# EAGLE design MIDITheremin10-24 (EAGLE 7.7.0)
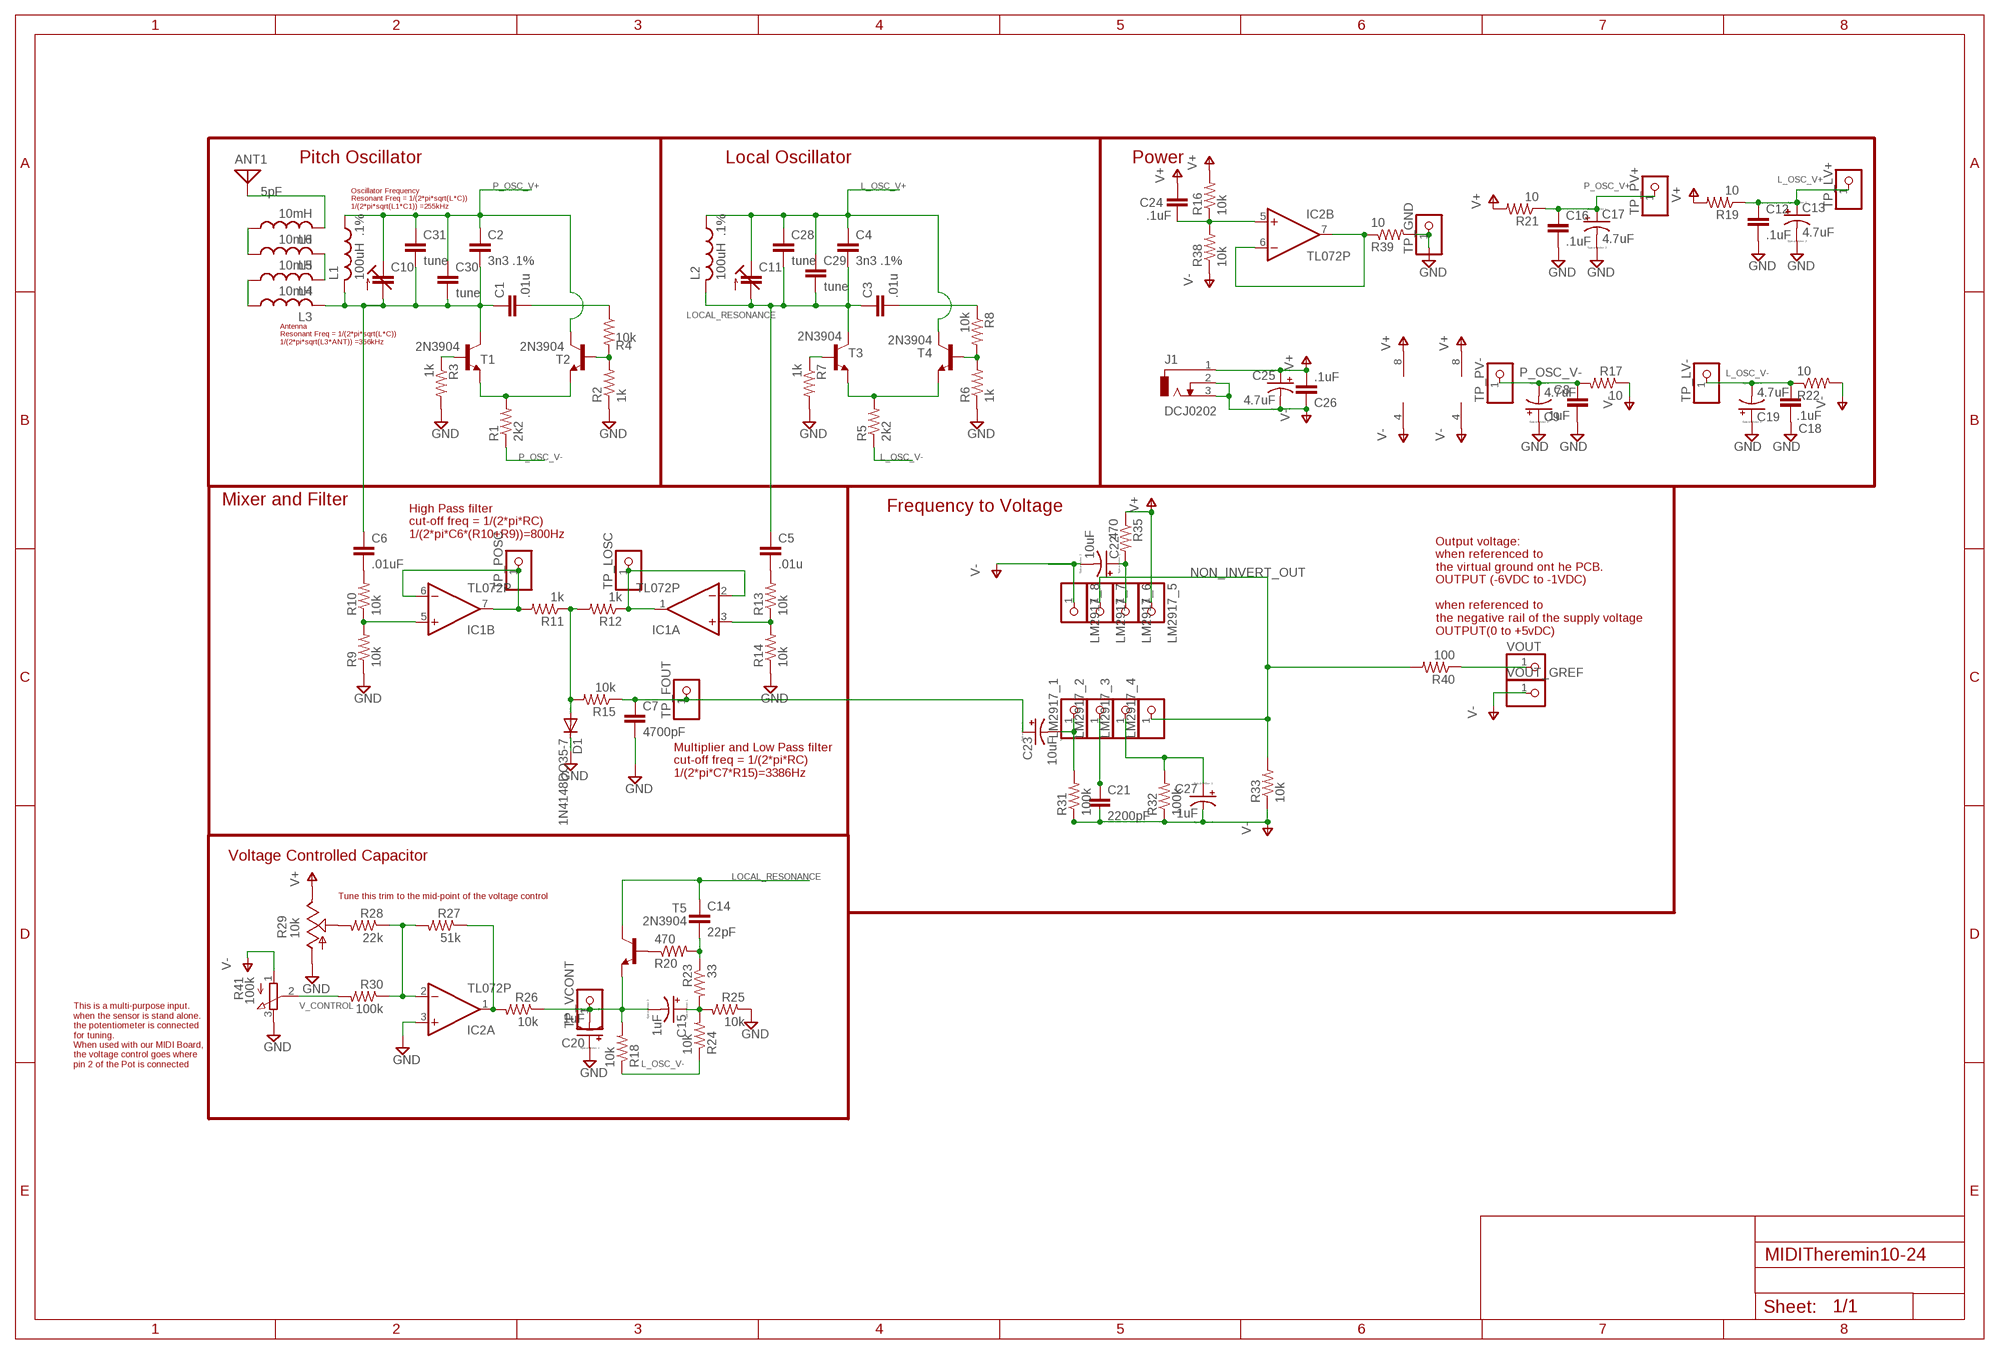
[diagram p0: schematic, sheet 1]

## Parts
ANT1  5pF  ANTENNA  [PAD-01]
C1  .01u  C-EU050-025X075  [C050-025X075]
C2  3n3 .1%  C-EU050-025X075  [C050-025X075]
C3  .01u  C-EU050-025X075  [C050-025X075]
C4  3n3 .1%  C-EU050-025X075  [C050-025X075]
C5  .01u  C-EU050-025X075  [C050-025X075]
C6  .01uF  C-EU050-025X075  [C050-025X075]
C7  4700pF  C-EU050-025X075  [C050-025X075]
C8  .1uF  C-EU050-025X075  [C050-025X075]
C9  4.7uF  CPOL-USE2.5-7  [E2,5-7]
C10  C-TRIMM3040.427  [CTRIM3040.427]
C11  C-TRIMM3040.427  [CTRIM3040.427]
C12  .1uF  C-EU050-025X075  [C050-025X075]
C13  4.7uF  CPOL-USE2.5-7  [E2,5-7]
C14  22pF  C-EU050-025X075  [C050-025X075]
C15  1uF  CPOL-USE2.5-7  [E2,5-7]
C16  .1uF  C-EU050-025X075  [C050-025X075]
C17  4.7uF  CPOL-USE2.5-7  [E2,5-7]
C18  .1uF  C-EU050-025X075  [C050-025X075]
C19  4.7uF  CPOL-USE2.5-7  [E2,5-7]
C20  1uF  CPOL-USE2.5-7  [E2,5-7]
C21  2200pF  C-EU050-025X075  [C050-025X075]
C22  10uF  CPOL-USE2.5-7  [E2,5-7]
C23  10uF  CPOL-USE2.5-7  [E2,5-7]
C24  .1uF  C-EU050-025X075  [C050-025X075]
C25  4.7uF  CPOL-USE2.5-7  [E2,5-7]
C26  .1uF  C-EU050-025X075  [C050-025X075]
C27  1uF  CPOL-USE2.5-7  [E2,5-7]
C28  tune  C-EU050-025X075  [C050-025X075]
C29  tune  C-EU050-025X075  [C050-025X075]
C30  tune  C-EU050-025X075  [C050-025X075]
C31  tune  C-EU050-025X075  [C050-025X075]
D1  1N4148DO35-7  [DO35-7]
IC1  TL072P  [DIL08]
IC2  TL072P  [DIL08]
J1  DCJ0202  [DCJ0202]
L1  100uH .1%  L-US6000-XXX-RC  [6000-XXXX-RC]
L2  100uH .1%  L-US6000-XXX-RC  [6000-XXXX-RC]
L3  10mH  L-US6000-XXX-RC  [6000-XXXX-RC]
L4  10mH  L-US6000-XXX-RC  [6000-XXXX-RC]
L5  10mH  L-US6000-XXX-RC  [6000-XXXX-RC]
L6  10mH  L-US6000-XXX-RC  [6000-XXXX-RC]
LM2917_1  PINHD-1X1  [1X01]
LM2917_2  PINHD-1X1  [1X01]
LM2917_3  PINHD-1X1  [1X01]
LM2917_4  PINHD-1X1  [1X01]
LM2917_5  PINHD-1X1  [1X01]
LM2917_6  PINHD-1X1  [1X01]
LM2917_7  PINHD-1X1  [1X01]
LM2917_8  PINHD-1X1  [1X01]
R1  2k2  R-US_0411/3V  [0411V]
R2  1k  R-US_0411/3V  [0411V]
R3  1k  R-US_0411/3V  [0411V]
R4  10k  R-US_0411/3V  [0411V]
R5  2k2  R-US_0411/3V  [0411V]
R6  1k  R-US_0411/3V  [0411V]
R7  1k  R-US_0411/3V  [0411V]
R8  10k  R-US_0411/3V  [0411V]
R9  10k  R-US_0411/3V  [0411V]
R10  10k  R-US_0411/3V  [0411V]
R11  1k  R-US_0411/3V  [0411V]
R12  1k  R-US_0411/3V  [0411V]
R13  10k  R-US_0411/3V  [0411V]
R14  10k  R-US_0411/3V  [0411V]
R15  10k  R-US_0411/3V  [0411V]
R16  10k  R-US_0411/3V  [0411V]
R17  10  R-US_0411/3V  [0411V]
R18  10k  R-US_0411/3V  [0411V]
R19  10  R-US_0411/3V  [0411V]
R20  470  R-US_0411/3V  [0411V]
R21  10  R-US_0411/3V  [0411V]
R22  10  R-US_0411/3V  [0411V]
R23  33  R-US_0411/3V  [0411V]
R24  10k  R-US_0411/3V  [0411V]
R25  10k  R-US_0411/3V  [0411V]
R26  10k  R-US_0411/3V  [0411V]
R27  51k  R-US_0411/3V  [0411V]
R28  22k  R-US_0411/3V  [0411V]
R29  10k  TRIM_US-B64Y  [B64Y]
R30  100k  R-US_0411/3V  [0411V]
R31  100k  R-US_0411/3V  [0411V]
R32  100k  R-US_0411/3V  [0411V]
R33  10k  R-US_0411/3V  [0411V]
R35  470  R-US_0411/3V  [0411V]
R38  10k  R-US_0411/3V  [0411V]
R39  10  R-US_0411/3V  [0411V]
R40  100  R-US_0411/3V  [0411V]
R41  100k  3RP/1610N  [3RP/1610N]
T1  2N3904  [TO92]
T2  2N3904  [TO92]
T3  2N3904  [TO92]
T4  2N3904  [TO92]
T5  2N3904  [TO92]
TP_FOUT  PINHD-1X1  [1X01]
TP_GND  PINHD-1X1  [1X01]
TP_LOSC  PINHD-1X1  [1X01]
TP_LV+  PINHD-1X1  [1X01]
TP_LV-  PINHD-1X1  [1X01]
TP_POSC  PINHD-1X1  [1X01]
TP_PV+  PINHD-1X1  [1X01]
TP_PV-  PINHD-1X1  [1X01]
TP_VCONT  PINHD-1X1  [1X01]
VOUT  PINHD-1X1  [1X01]
VOUT_GREF  PINHD-1X1  [1X01]

## Nets
ANT: ANT1.1 L6.2
GND: C7.2 C8.2 C9.+ C12.2 C13.- C16.2 C17.- C18.2 C19.+ C20.+ D1.C IC2.3(A:+IN) R2.1 R3.2 R6.1 R7.2 R9.1 R14.1 R25.1 R29.A R39.2 R41.3(E) TP_GND.1
L_OSC_V+: C4.1 C11.1A(E) C12.1 C13.+ C28.1 C29.1 L2.1 R19.1 T4.1(C) TP_LV+.1
L_OSC_V-: C18.1 C19.- R5.1 R18.1 R22.1 R24.1 TP_LV-.1
LOCAL_RESONANCE: C3.1 C4.2 C5.1 C11.2(A) C14.1 C28.2 C29.2 L2.2 T3.1(C) T5.1(C)
N$1: R1.2 T1.3(E) T2.3(E)
N$2: R2.2 R4.2 T2.2(B)
N$3: R3.1 T1.2(B)
N$4: C1.1 C2.2 C6.1 C10.2(A) C30.2 C31.2 L1.2 L3.2 T1.1(C)
N$5: C1.2 R4.1
N$6: R5.2 T3.3(E) T4.3(E)
N$7: R6.2 R8.2 T4.2(B)
N$8: R7.1 T3.2(B)
N$9: C15.- C20.- R18.2 R26.1 T5.3(E) TP_VCONT.1
N$10: C5.2 R13.2
N$11: IC1.6(B:-IN) IC1.7(B:OUT) R11.2 TP_POSC.1
N$12: IC1.1(A:OUT) IC1.2(A:-IN) R12.1 TP_LOSC.1
N$13: IC1.5(B:+IN) R9.2 R10.1
N$14: D1.A R11.1 R12.2 R15.2
N$15: IC1.3(A:+IN) R13.1 R14.2
N$16: C3.2 R8.1
N$17: C6.2 R10.2
N$18: C7.1 C23.+ R15.1 TP_FOUT.1
N$19: L5.1 L6.1
N$20: C21.1 LM2917_2.1
N$21: R20.1 T5.2(B)
N$22: C14.2 R20.2 R23.1
N$23: C15.+ R23.2 R24.2 R25.2
N$24: IC2.1(A:OUT) R26.2 R27.1
N$25: IC2.2(A:-IN) R27.2 R28.1 R30.1
N$26: R28.2 R29.S
N$27: IC2.6(B:-IN) IC2.7(B:OUT) R39.1
N$28: L3.1 L4.1
N$31: C22.+ LM2917_6.1 R35.2
N$33: C27.+ LM2917_3.1 R32.2
N$34: C23.- LM2917_1.1 R31.2
N$35: L4.2 L5.2
N$36: C24.2 IC2.5(B:+IN) R16.1 R38.2
N$38: R40.1 VOUT.1
NON_INVERT_OUT: LM2917_4.1 LM2917_7.1 R33.2 R40.2
P_OSC_V+: C2.1 C10.1A(E) C16.1 C17.+ C30.1 C31.1 L1.1 R21.1 T2.1(C) TP_PV+.1
P_OSC_V-: C8.1 C9.- R1.1 R17.2 TP_PV-.1
V+: C24.1 C25.+ C26.2 IC1.8(P:V+) IC2.8(P:V+) J1.1 LM2917_5.1 R16.2 R19.2 R21.2 R29.E R35.1
V-: C21.2 C22.- C25.- C26.1 C27.- IC1.4(P:V-) IC2.4(P:V-) J1.2 J1.3 LM2917_8.1 R17.1 R22.2 R31.1 R32.1 R33.1 R38.1 R41.1(A) VOUT_GREF.1
V_CONTROL: R30.2 R41.2(S)

## Notes on the sheet
- Pitch Oscillator | Local Oscillator | Power
- Oscillator Frequency
  Resonant Freq = 1/(2*pi*sqrt(L*C)) 
  1/(2*pi*sqrt(L1*C1)) =255kHz
- Antenna
  Resonant Freq = 1/(2*pi*sqrt(L*C)) 
  1/(2*pi*sqrt(L3*ANT)) =356kHz
- Mixer and Filter
- Frequency to Voltage
- High Pass filter
  cut-off freq = 1/(2*pi*RC) 
  1/(2*pi*C6*(R10+R9))=800Hz
- Output voltage: 
  when referenced to 
  the virtual ground ont he PCB.
  OUTPUT (-6VDC to -1VDC)
  
  when referenced to 
  the negative rail of the supply voltage
  OUTPUT(0 to +5vDC)
- Multiplier and Low Pass filter
  cut-off freq = 1/(2*pi*RC) 
  1/(2*pi*C7*R15)=3386Hz
- Voltage Controlled Capacitor
- Tune this trim to the mid-point of the voltage control
- This is a multi-purpose input.
  when the sensor is stand alone.
  the potentiometer is connected 
  for tuning. 
  When used with our MIDI Board, 
  the voltage control goes where
  pin 2 of the Pot is connected

## Library data of the parts
ANT1 = discrete:ANTENNA: Antenna
C1-C8 C12 C14 C16 C18 C21 C24 C26 C28-C31 = resistor:C-EU: CAPACITOR, European symbol
C9 C13 C15 C17 C19 C20 C22 C23 C25 C27 = resistor:CPOL-US: POLARIZED CAPACITOR, American symbol
C10 C11 = rcl:C-TRIMM: Trimm capacitor
D1 = diode:1N4148: DIODE high speed (Philips)
IC1 IC2 = linear:TL072: OP AMP
J1 = con-jack:DCJ0202: DC POWER JACK Source: DCJ0202.pdf; OC_FARNELL: unknown; OC_NEWARK: unknown
L1-L6 = rcl:L-US: INDUCTOR, American symbol
LM2917_1-LM2917_8 TP_FOUT TP_GND TP_LOSC TP_LV+ TP_LV- TP_POSC TP_PV+ TP_PV- TP_VCONT VOUT VOUT_GREF = pinhead:PINHD-1X1: PIN HEADER
R1-R28 R30 R38 R39 = resistor:R-US_: RESISTOR, American symbol
R29 = pot:TRIM_US-: POTENTIOMETER
R31-R33 R35 R40 = rcl:R-US_: RESISTOR, American symbol
R41 = pot:3RP/1610N: 16mm Potentiometer one level Source: http://www.alphapotentiometers.net/html/16mm_pot_2.html
T1-T5 = transistor-neu-to92:2N3904: NPN TRANSISTOR

## Board
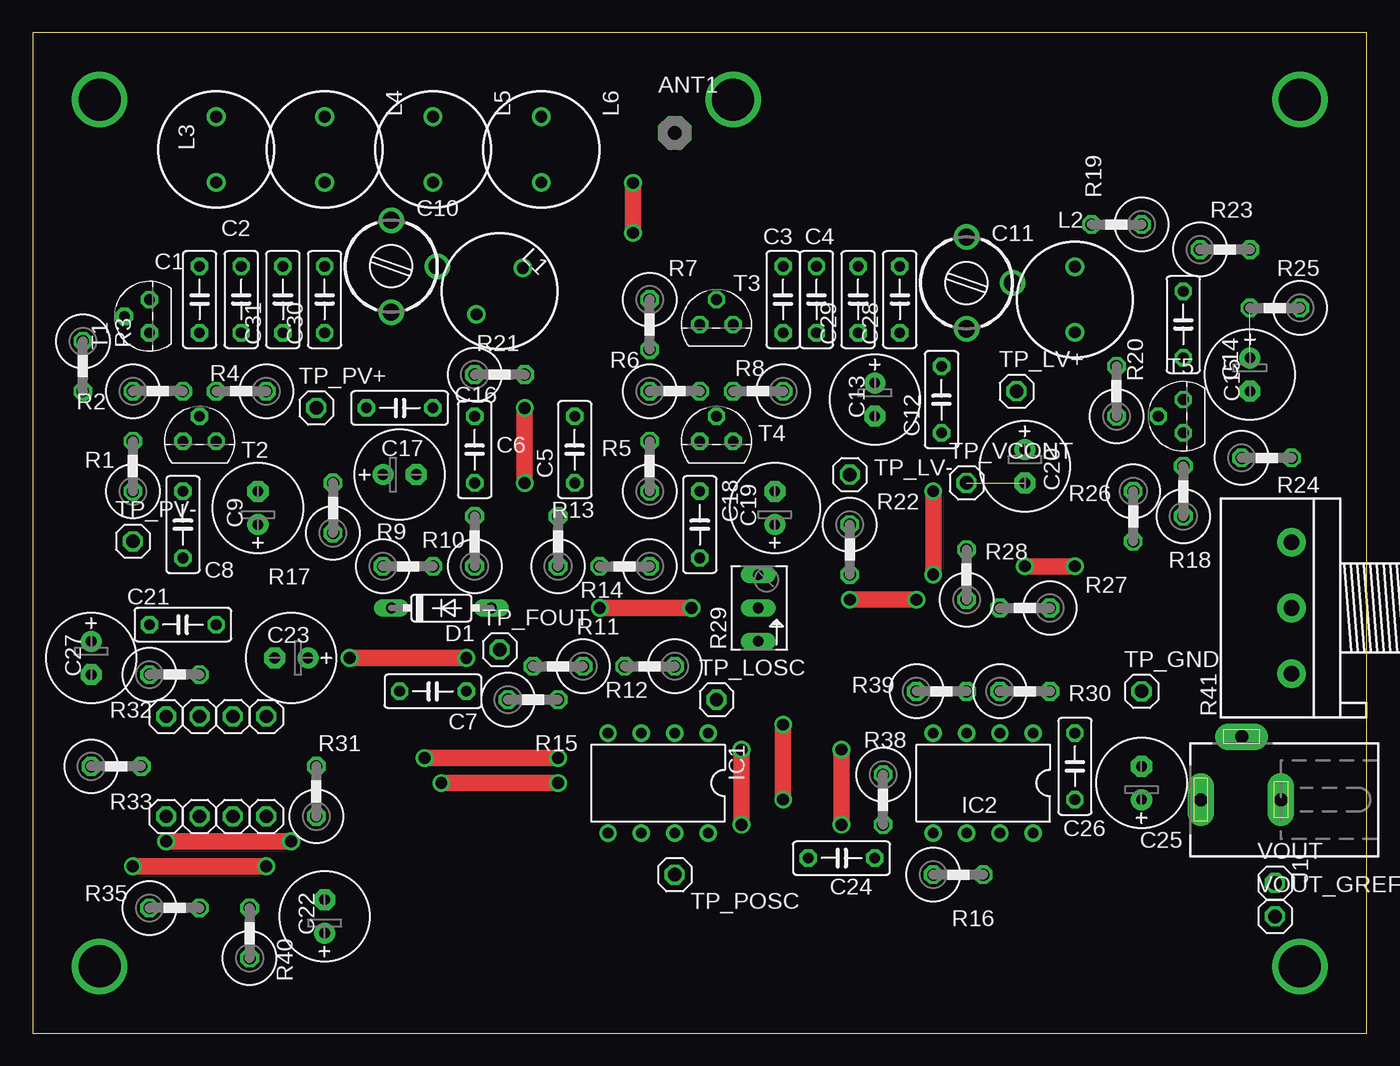
[diagram p1: board, top side]
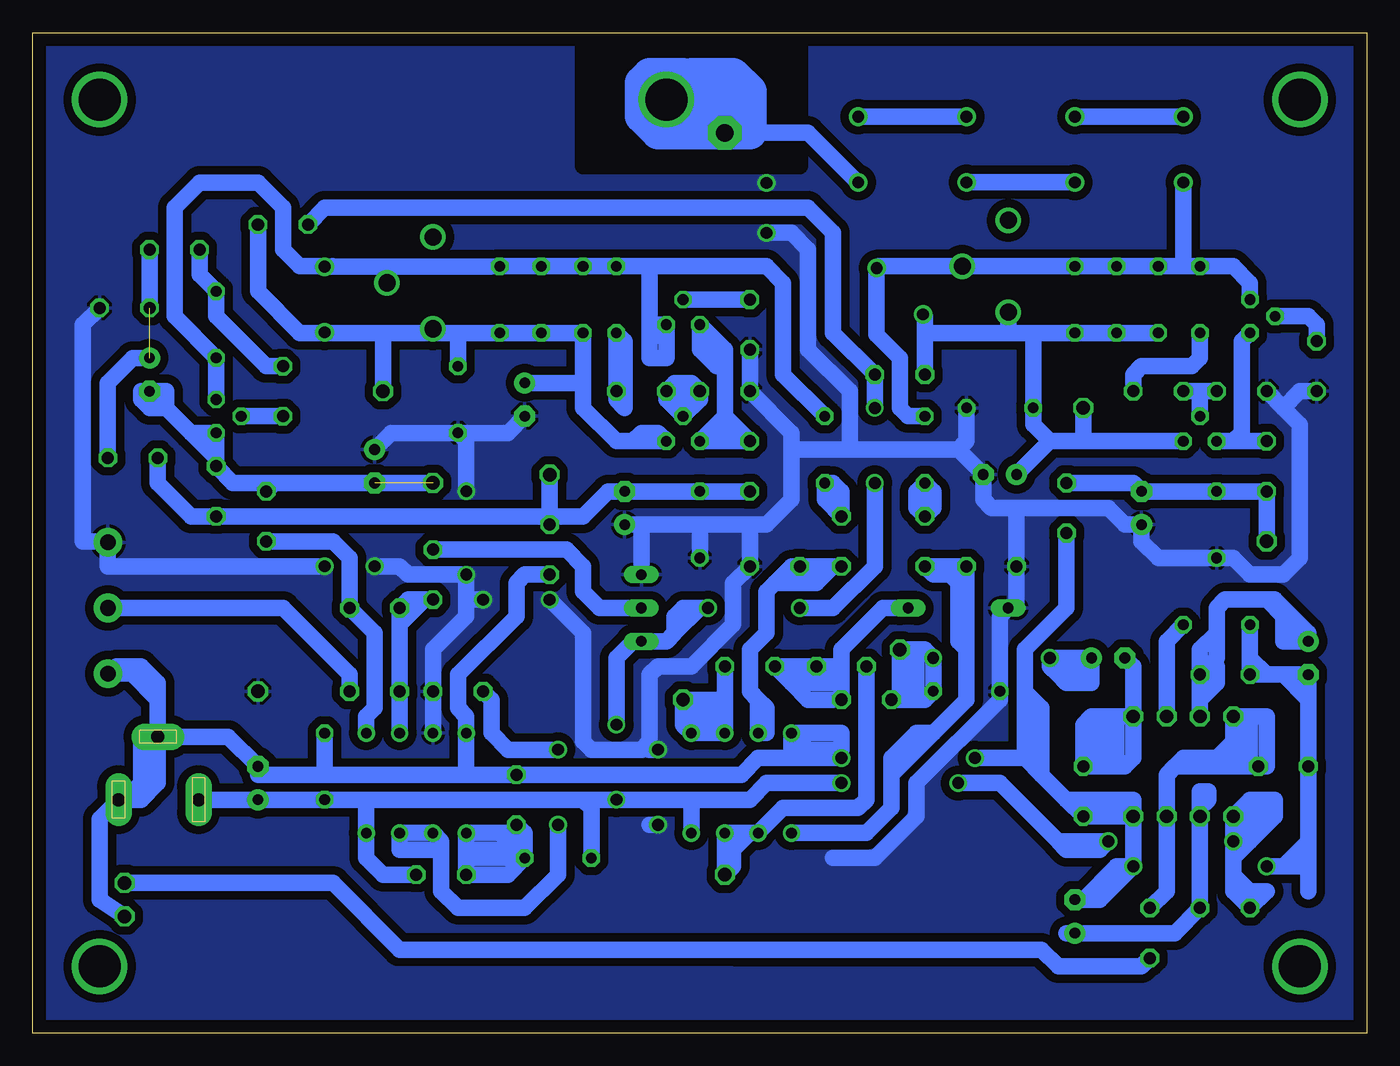
[diagram p2: board, bottom side, seen from below]

Size 101.6 x 76.2 mm. Coordinates in mm from the lower left corner, seen from the top.
Outline: 0,0 101.6,0 101.6,76.2 0,76.2 0,0
Copper layers (1*16): Top 0.035mm / dielectric 1.5mm / Bottom 0.035mm
Design rules "default": minimum track width 10mil, minimum drill 24mil, track to track 8mil, track to pad 8mil, pad to pad 8mil, via to via 8mil, smd to smd 8mil, copper to edge 40mil, drill to drill 8mil, minimum pad ring 10mil, minimum via ring 8mil, stop-mask expansion 4mil, vias tented up to drill 0mil, thermal gap 10mil
tRestrict: area 12.7,60.3 to 28.6,68.6
bRestrict: area 43.2,66 to 59.7,76.2

### Footprints (pad centres in the part's own frame; a part is rotated, then mirrored left to right if it is on the bottom)
PAD-01 = drill 1.321 pad 2.54 octagon: 1 0,0
C050-025X075 = drill 0.813 octagon: 1 -2.54,0; 2 2.54,0
E2,5-7 = drill 0.813 pad 1.6: + -1.27,0 | drill 0.813 pad 1.6 octagon: - 1.27,0
CTRIM3040.427 = drill 1.3: 1A -3.5,0; 1B 3.5,0; 2 0,-3.5
DO35-7 = drill 0.813 long: A 3.81,0; C -3.81,0
DIL08 = drill 0.813 pad 1.27: 1 -3.81,-3.81; 2 -1.27,-3.81; 3 1.27,-3.81; 4 3.81,-3.81; 5 3.81,3.81; 6 1.27,3.81; 7 -1.27,3.81; 8 -3.81,3.81
DCJ0202 = drill 1 pad 2 long: 1 0,3.1; 2 4.8,0; 3 0,-3
6000-XXXX-RC = drill 0.9 pad 1.422: 1 -2.5,0; 2 2.5,0
1X01 = drill 1.016 octagon: 1 0,0
0411V = drill 0.914 octagon: 1 -2.54,0; 2 1.27,0
B64Y = drill 0.813 long: A 2.54,0; E -2.54,0; S 0,0
3RP/1610N = drill 1.2 pad 2.184: 1 -5,0; 2 0,0; 3 5,0
TO92 = drill 0.813 octagon: 1 1.27,0; 2 0,1.905; 3 -1.27,0

### Placement (x,y rotation side)
ANT1  48.9,68.58 0 top
C1  12.7,55.88 270 top
C2  15.88,55.88 90 top
C3  57.15,55.88 270 top
C4  59.69,55.88 90 top
C5  41.27,44.45 270 top
C6  33.66,44.45 270 top
C7  30.48,26.04 180 top
C8  11.43,38.73 270 top
C9  17.14,40.01 90 top
C10  27.3,58.42 90 top
C11  71.12,57.15 90 top
C12  69.22,48.26 270 top
C13  64.14,48.26 270 top
C14  87.63,53.98 90 top
C15  92.71,50.16 270 top
C16  27.94,47.62 0 top
C17  27.94,42.55 0 top
C18  50.8,38.73 270 top
C19  56.52,40.01 90 top
C20  75.56,43.18 270 top
C21  11.43,31.11 180 top
C22  22.23,8.89 90 top
C23  19.68,28.57 180 top
C24  61.59,13.34 0 top
C25  84.45,19.05 90 top
C26  79.38,20.32 270 top
C27  4.45,28.57 270 top
C28  66.04,55.88 90 top
C29  62.87,55.88 90 top
C30  22.23,55.88 90 top
C31  19.05,55.88 90 top
D1  31.11,32.38 0 top
IC1  47.62,19.05 180 top
IC2  72.39,19.05 180 top
J1  92.08,17.78 90 top
L1  35.56,56.52 45 top
L2  79.38,55.88 90 top
L3  13.97,67.31 270 top
L4  22.23,67.31 270 top
L5  30.48,67.31 270 top
L6  38.73,67.31 270 top
LM2917_1  17.78,24.13 90 top
LM2917_2  15.24,24.13 90 top
LM2917_3  12.7,24.13 90 top
LM2917_4  10.16,24.13 90 top
LM2917_5  10.16,16.51 90 top
LM2917_6  12.7,16.51 90 top
LM2917_7  15.24,16.51 90 top
LM2917_8  17.78,16.51 90 top
R1  7.62,43.81 90 top
R2  10.16,48.9 0 top
R3  3.81,50.16 270 top
R4  15.24,48.9 180 top
R5  46.99,43.81 90 top
R6  49.53,48.9 0 top
R7  46.99,53.34 270 top
R8  54.61,48.9 180 top
R9  29.21,35.56 0 top
R10  33.66,38.1 90 top
R11  39.37,27.94 180 top
R12  46.35,27.94 180 top
R13  40.01,38.1 90 top
R14  44.45,35.56 180 top
R15  38.73,25.4 0 top
R16  71.12,12.06 0 top
R17  22.86,40.64 90 top
R18  87.63,41.91 90 top
R19  81.92,61.59 180 top
R20  82.55,49.53 90 top
R21  36.2,50.16 0 top
R22  62.23,36.2 270 top
R23  91.44,59.69 0 top
R24  94.61,43.81 0 top
R25  93.98,55.24 180 top
R26  83.82,38.73 270 top
R27  74.93,32.38 180 top
R28  71.12,35.56 90 top
R29  55.24,32.38 90 top
R30  76.2,26.04 0 top
R31  21.59,19.05 90 top
R32  11.43,27.3 0 top
R33  6.99,20.32 0 top
R35  11.43,9.53 0 top
R38  64.77,17.14 270 top
R39  69.85,26.04 0 top
R40  16.51,8.26 90 top
R41  95.89,32.38 90 top
T1  8.89,54.61 90 top
T2  12.7,45.09 0 top
T3  52.07,53.98 0 top
T4  52.07,45.09 0 top
T5  87.63,46.99 90 top
TP_FOUT  35.56,29.21 0 top
TP_GND  84.45,26.04 0 top
TP_LOSC  52.07,25.4 0 top
TP_LV+  74.93,48.9 0 top
TP_LV-  62.23,42.55 0 top
TP_POSC  48.9,12.06 0 top
TP_PV+  21.59,47.62 0 top
TP_PV-  7.62,37.47 0 top
TP_VCONT  71.12,41.91 0 top
VOUT  94.61,11.43 0 top
VOUT_GREF  94.61,8.89 0 top

### Tracks (layer width: path | path; a pad name or v marks a point on that pad's centre or on a via)
ANT  (via drill 3.2)
  Bottom 1.27: L6.2 38.77,64.81 42.55,68.58 46.99,68.58
  Bottom 2.54: ANT1.1 53.98,68.58 55.24,69.85 55.24,72.39 54.61,73.03 52.07,73.03 51.44,72.39 | 51.44,72.39 51.44,71.12 | ANT1.1 50.8,68.58 v53.34,71.12 | ANT1.1 46.99,68.58 46.99,71.75 48.26,73.03 51.44,73.03 51.44,72.39 | 51.44,71.12 51.44,70.48 50.8,70.48 | 47.62,70.48 50.8,70.48 | 50.8,70.48 51.44,71.12
GND  (via drill 0.9)
  Top 1.27: v68.58,41.27 v68.58,34.92 | v79.38,35.56 v75.56,35.56 | v45.72,60.96 v45.72,64.77 | v62.23,33.02 v67.31,33.02 | v53.98,21.59 v53.98,15.88
  Bottom 1.27: R7.2 R6.1 43.81,45.72 43.81,44.45 | 6.35,47.62 5.08,46.35 5.08,36.2 6.35,34.92 8.89,34.92 10.16,36.2 C8.2 15.88,36.2 17.14,37.47 C9.+ 18.41,38.73 19.68,40.01 26.67,40.01 | 6.35,47.62 R2.1 | C19.+ 55.24,38.73 | 55.24,38.73 50.8,38.73 | 50.8,38.73 46.99,38.73 | 46.99,38.73 45.72,38.73 43.81,40.64 43.81,44.45 | C18.2 50.8,38.73 | 46.99,38.73 R14.1 48.26,34.29 48.26,31.11 51.44,27.94 53.98,27.94 54.61,27.3 54.61,22.23 55.24,21.59 59.05,21.59 59.69,22.23 59.69,30.48 v62.23,33.02 | 26.67,40.01 R9.1 26.67,32.38 D1.C 27.94,31.75 C7.2 27.94,25.4 34.29,19.05 34.29,16.51 37.47,13.34 40.64,13.34 | 43.81,44.45 39.37,44.45 | IC2.3 R39.2 71.12,29.21 68.58,31.75 68.58,33.02 | v75.56,35.56 73.66,35.56 73.03,34.92 v68.58,34.92 68.58,33.02 | v79.38,35.56 95.89,35.56 95.89,37.47 97.79,37.47 97.79,53.98 R25.1 | R29.A 55.24,38.73 | v68.58,41.27 68.58,45.09 C12.2 | v67.31,33.02 68.58,33.02 | v45.72,60.96 43.81,60.96 42.55,59.69 42.55,52.07 39.37,48.9 39.37,44.45 | 54.61,21.59 v53.98,21.59 | v53.98,15.88 54.61,15.88 | C20.+ 74.3,45.72 C12.2 | C12.2 65.41,45.72 C13.- | R3.2 5.08,48.9 6.35,47.62 | 26.67,40.01 28.57,40.01 29.21,40.64 C17.- 31.11,44.45 | 39.37,44.45 31.11,44.45 | C16.2 30.48,45.09 31.11,44.45
  pour Bottom (isolate 0.635): 0,0 101.6,0 101.6,76.2 0,76.2
  pour Bottom: 48.26,5.08 48.26,0 89.53,0 89.53,5.08
L_OSC_V+
  Bottom 1.27: 55.88,45.09 T4.1 53.98,45.72 55.24,45.72 55.88,45.09 | 55.88,45.09 57.15,45.09 59.69,47.62 59.69,49.53 | 59.69,49.53 C4.1 C29.1 C28.1 69.22,53.34 | 69.22,53.34 71.12,53.34 | 71.12,53.34 74.93,53.34 | 74.93,53.34 79.33,53.34 L2.1 79.42,53.34 81.28,53.34 84.45,56.52 R19.1 | C13.+ 59.69,49.53 | C12.1 69.22,53.34 | C11.1A 71.12,53.34 | TP_LV+.1 74.93,53.34
L_OSC_V-
  Bottom 1.27: R5.1 C18.1 C19.- 57.78,41.27 59.69,39.37 62.23,39.37 | 62.23,39.37 R18.1 89.53,39.37 92.08,41.91 R24.1 | TP_LV-.1 62.23,39.37 | 62.23,39.37 R22.1
LOCAL_RESONANCE
  Bottom 1.27: 54.61,58.42 45.72,58.42 44.45,57.15 44.45,50.16 C5.1 | 54.61,58.42 C3.1 C4.2 C29.2 C28.2 66.72,58.38 74.93,58.38 | 54.61,53.98 T3.1 53.34,52.7 | 53.34,52.7 54.61,53.98 | 53.34,52.7 53.34,51.44 54.61,51.44 54.61,53.98 | 54.61,53.98 54.61,58.42 | T5.1 C14.1 90.81,54.61 90.81,62.87 88.9,64.77 84.45,64.77 82.55,62.87 82.55,59.69 81.28,58.42 79.42,58.42 L2.2 | L2.2 74.93,58.38 | 78.78,58.42 L2.2 | C11.2 74.62,58.07 74.93,58.38
N$1
  Bottom 1.27: R1.2 T2.3 10.16,45.09 9.53,45.72 9.53,52.7 T1.3
N$2
  Bottom 1.27: R4.2 12.7,48.9 | 12.7,48.9 R2.2 | T2.2 12.7,48.9
N$3
  Bottom 1.27: R3.1 3.81,53.98 4.45,54.61 T1.2
N$4
  Bottom 1.27: 30.84,58.38 C10.2 | C10.2 C30.2 C31.2 C2.2 13.97,58.42 | 13.97,58.42 C1.1 10.16,58.42 8.89,57.15 T1.1 | C6.1 34.92,46.99 35.56,47.62 35.56,51.44 37.33,53.2 L1.2 37.19,58.42 C10.2 | L3.2 13.97,58.42
N$5
  Bottom 1.27: R4.1 17.78,50.16 17.14,50.8 13.34,50.8 12.7,51.44 C1.2
N$6
  Bottom 1.27: 48.9,46.99 T4.3 R5.2 | 48.9,46.99 48.9,52.07 T3.3 50.8,52.07 49.53,50.8 49.53,51.44 50.16,52.07 | R5.2 48.9,46.99 | R5.2 48.26,45.09 48.9,45.72
N$7
  Bottom 1.27: R8.2 52.07,48.9 | 52.07,48.9 R6.2 | T4.2 52.07,48.9 | R6.2 51.44,49.53 52.7,49.53 R8.2 | R8.2 53.34,48.26 T4.2 | T4.2 50.8,48.26 R6.2
N$8
  Bottom 1.27: T3.2 R7.1
N$9  (1 unrouted)
  Bottom 1.27: 87.63,43.81 T5.3 89.53,45.72 | 87.63,43.81 R18.2 86.36,41.91 83.19,41.91 | C15.- 91.44,47.62 | 91.44,47.62 89.53,45.72 | C15.- 91.44,48.9 91.44,47.62 | C15.- 93.34,48.9 93.34,48.26 92.71,47.62 91.44,47.62 | 87.63,43.81 89.53,45.72 | TP_VCONT.1 83.19,41.91 | 83.19,41.91 R26.1
N$10
  Bottom 1.27: R13.2 41.27,40.64 C5.2 40.64,41.91 40.01,41.27 R13.2
N$11
  Bottom 1.27: IC1.6 IC1.7 TP_POSC.1 48.26,12.7 48.26,13.97 46.99,15.24 IC1.6 | IC1.6 44.45,17.14 38.73,17.14 38.1,17.78 R11.2
N$12
  Bottom 1.27: 48.9,24.13 IC1.2 IC1.1 52.07,23.5 52.07,24.13 | 48.9,25.4 R12.1 | 52.07,24.13 TP_LOSC.1 48.9,25.4 | 48.9,25.4 48.9,24.13 | 48.9,24.13 52.07,24.13
N$13
  Bottom 1.27: IC1.5 38.1,15.24 36.2,17.14 36.2,19.68 | 30.48,29.21 30.48,25.4 33.02,22.86 | 30.48,29.21 R9.2 R10.1 33.02,34.92 31.75,34.92 31.11,34.29 31.11,29.84 30.48,29.21 | 33.02,22.86 36.2,19.68 | 36.2,19.68 36.2,20.95 34.29,22.86 33.02,22.86
N$14
  Bottom 1.27: 40.01,27.94 40.01,29.21 36.83,32.38 D1.A | 40.01,27.94 40.01,26.67 | 40.01,26.67 R15.2 | 40.01,27.94 R11.1 R12.2 43.81,26.67 | 40.64,25.4 42.55,25.4 43.81,26.67 | 43.81,26.67 40.01,26.67
N$15
  Bottom 1.27: 40.64,35.56 R14.2 43.81,35.56 45.09,34.29 | 40.64,35.56 R13.1 | 46.35,25.4 IC1.3 45.72,22.86 45.72,24.77 46.35,25.4 | 46.35,25.4 46.99,26.04 46.99,29.21 45.72,30.48 45.72,33.66 45.09,34.29 | 40.64,35.56 41.91,34.29 45.09,34.29
N$16
  Bottom 1.27: C3.2 R8.1 57.15,48.26 56.52,47.62 56.52,52.7 C3.2
N$17
  Bottom 1.27: C6.2 R10.2 | R10.2 33.02,40.01 33.02,41.27 C6.2 | C6.2 34.29,41.27 34.29,40.01 R10.2
N$18  (via drill 0.9)
  Top 1.27: v24.13,28.57 v33.02,28.57
  Bottom 1.27: R15.1 35.56,25.4 | 34.29,25.4 33.66,25.4 C7.1 v33.02,28.57 33.66,29.21 34.29,29.21 | 22.86,28.57 v24.13,28.57 | v24.13,28.57 C23.+ 20.95,27.3 | 34.29,29.21 TP_FOUT.1 35.56,25.4 | 35.56,25.4 34.29,25.4 | 34.29,25.4 34.29,29.21 | 20.95,27.3 20.95,26.67 22.86,26.67 23.5,27.3 | 23.5,27.3 24.13,27.94 v24.13,28.57 | 20.95,27.3 23.5,27.3
N$19
  Bottom 1.27: L5.1 L6.1
N$20
  Bottom 1.27: LM2917_2.1 15.24,29.84 C21.1
N$21
  Bottom 1.27: T5.2 R20.1
N$22
  Bottom 1.27: R23.1 88.9,57.78 C14.2 87.63,54.61 83.82,50.8 R20.2
N$23  (1 unrouted)
  Bottom 1.27: R24.2 95.89,49.53 93.98,51.44 C15.+ | R23.2 R25.2
N$24
  Bottom 1.27: IC2.1 76.2,24.13 75.56,24.77 75.56,30.48 R27.1 77.47,36.2 78.74,37.47 R26.2
N$25
  Bottom 1.27: IC2.2 R30.1 73.66,31.11 | 73.66,31.11 R27.2 73.03,33.02 R28.1 71.75,33.02 73.66,31.11
N$26
  Bottom 1.27: R28.2 60.96,36.83 59.69,35.56 59.69,33.66 58.42,32.38 R29.S
N$27  (via drill 0.9)
  Top 1.27: v61.59,21.59 v61.59,15.88
  Bottom 1.27: 70.48,13.97 70.48,14.61 IC2.6 IC2.7 73.66,13.97 70.48,13.97 | 70.48,13.97 70.48,10.79 69.22,9.53 64.14,9.53 61.59,12.06 v61.59,15.88 | v61.59,21.59 65.41,21.59 66.67,22.86 66.67,25.4 R39.1
N$28
  Bottom 1.27: L3.1 L4.1
N$29  (via drill 3.2)
  other vias: 96.52,5.08
N$30  (via drill 3.2)
  other vias: 96.52,71.12
N$31
  Bottom 1.27: 22.86,7.62 C22.+ 14.61,7.62 R35.2 LM2917_6.1 12.7,17.14 | 12.7,17.14 12.7,18.41 12.06,18.41 12.06,17.78 12.7,17.14
N$32  (via drill 3.2)
  other vias: 5.08,71.12
N$33
  Bottom 1.27: LM2917_3.1 12.7,25.4 | 12.7,25.4 R32.2 | 7.62,33.02 6.99,33.02 4.45,30.48 C27.+ 6.35,29.84 | 7.62,33.02 10.79,33.02 11.43,32.38 11.43,30.48 | 11.43,30.48 11.43,28.57 R32.2 | R32.2 12.7,29.21 11.43,30.48 | 11.43,27.94 11.43,26.67 12.7,25.4 | 6.35,29.84 5.71,30.48 6.35,30.48 | 6.35,30.48 6.35,31.75 7.62,33.02 | 6.35,30.48 6.35,29.84
N$34
  Bottom 1.27: 20.32,20.32 19.05,20.32 | 19.05,20.32 18.41,20.32 17.78,20.95 LM2917_1.1 17.78,27.94 C23.- | 18.41,24.13 19.05,24.13 | 20.32,24.13 20.95,24.13 21.59,23.5 R31.2 20.32,20.32 | 20.32,20.32 20.32,24.13 | 20.32,24.13 19.05,24.13 | 19.05,24.13 19.05,20.32
N$35
  Bottom 1.27: L4.2 L5.2
N$36
  Bottom 1.27: 68.58,13.97 IC2.5 65.41,15.24 | 68.58,13.97 68.58,13.34 | 68.58,13.97 66.04,13.97 64.77,15.24 R38.2 64.14,15.24 C24.2 65.41,12.06 R16.1 68.58,13.34 | 68.58,13.34 65.41,13.34 64.77,13.97
N$37  (via drill 3.2)
  other vias: 5.08,5.08
N$38
  Bottom 1.27: VOUT.1 78.74,11.43 73.66,6.35 24.77,6.35 23.5,5.08 17.14,5.08 R40.1
NON_INVERT_OUT
  Bottom 1.27: 10.16,20.32 10.16,22.23 | 10.16,22.23 LM2917_4.1 8.89,24.13 | 14.61,20.32 15.24,19.68 LM2917_7.1 15.24,10.79 R40.2 | 14.61,20.32 10.16,20.32 | 10.16,20.32 8.89,20.32 | 8.89,20.32 R33.2 7.62,20.32 7.62,24.13 8.89,24.13 | 8.89,24.13 8.89,20.32 | 14.61,20.32 13.97,20.95 11.43,20.95 10.16,22.23
P_OSC_V+
  Bottom 1.27: T2.1 21.59,45.09 | 24.13,45.09 C17.+ | 24.13,45.09 25.4,46.35 C16.1 25.4,53.34 | C2.1 C31.1 C30.1 25.4,53.34 | 25.4,53.34 27.3,53.34 | 27.3,53.34 33.66,53.34 | 24.13,45.09 21.59,45.09 | 21.59,45.09 TP_PV+.1 | R21.1 33.66,53.34 | C10.1A 27.3,53.34 | 33.66,53.34 33.66,54.61 L1.1
P_OSC_V-
  Bottom 1.27: R17.2 17.78,41.91 C9.- C8.1 R1.1 TP_PV-.1
V+  (via drill 0.9)
  Top 1.27: v37.47,41.91 v37.47,47.62 | v57.15,17.78 v57.15,23.5 | v50.16,32.38 v43.18,32.38 | v40.01,19.05 v31.11,19.05 | v10.16,14.61 v19.68,14.61
  Bottom 1.27: 76.2,17.78 IC2.8 76.2,13.34 74.93,12.06 R16.2 | 51.44,17.78 v57.15,17.78 59.69,17.78 | v43.18,32.38 40.64,32.38 37.47,35.56 v37.47,41.91 | 76.2,17.78 C26.2 C25.+ J1.1 | 76.2,17.78 59.69,17.78 | C24.1 59.05,17.14 59.69,17.78 | 10.16,13.34 v10.16,14.61 LM2917_5.1 | 10.16,13.34 10.16,12.06 | 10.16,12.06 10.16,10.79 R35.1 7.62,10.79 8.89,10.79 10.16,12.06 | IC1.8 51.44,17.78 | 51.44,17.78 46.99,17.78 45.72,19.05 v40.01,19.05 | v31.11,19.05 27.94,19.05 23.5,14.61 | 23.5,14.61 v19.68,14.61 20.32,13.97 22.86,13.97 23.5,14.61 | v50.16,32.38 50.8,32.38 | 50.8,32.38 52.07,32.38 52.7,31.75 52.7,30.48 | 52.7,30.48 53.34,29.84 R29.E 55.88,29.84 57.15,28.57 v57.15,23.5 | v37.47,47.62 R21.2 40.64,53.34 40.64,60.96 42.55,62.87 79.38,62.87 R19.2 | LM2917_5.1 8.89,16.51 | 8.89,16.51 8.89,15.88 | 8.89,14.61 10.16,13.34 | LM2917_5.1 8.89,17.78 | 8.89,17.78 8.89,16.51 | 8.89,17.78 6.99,17.78 6.99,16.51 8.89,14.61 | 8.89,14.61 8.89,15.88 | 8.89,15.88 7.62,17.14 | 50.8,32.38 52.7,30.48
V-  (via drill 0.9)
  Top 1.27: v40.01,20.95 v29.84,20.95 | v17.78,12.7 v7.62,12.7
  Bottom 1.27: 43.81,21.59 IC1.4 40.01,22.86 40.01,21.59 42.55,21.59 43.18,22.23 43.81,21.59 | 43.81,21.59 43.81,20.95 | 68.58,19.68 IC2.4 68.58,24.13 69.22,24.77 69.22,27.3 64.77,31.75 64.77,34.29 64.14,34.92 R22.2 | 43.81,20.95 v40.01,20.95 | 26.04,26.04 26.04,29.21 22.86,32.38 R17.1 | 26.04,26.04 26.04,20.95 | 43.81,20.95 46.35,20.95 47.62,19.68 R38.1 68.58,19.68 | 68.58,19.68 79.38,19.68 | 79.38,19.68 84.45,19.68 C25.- 86.72,22.58 J1.2 | v17.78,12.7 20.32,10.16 21.59,10.16 | 21.59,10.16 C22.- | LM2917_8.1 v17.78,12.7 | C21.2 8.89,28.57 | 8.89,28.57 R32.1 7.62,27.3 | 7.62,27.3 6.35,27.3 | 6.35,27.3 C27.- 4.45,25.4 | 4.45,25.4 R33.1 4.45,14.61 | LM2917_8.1 R31.1 22.86,17.78 | 22.86,17.78 24.77,19.68 | 24.77,19.68 26.04,20.95 | v29.84,20.95 26.04,20.95 | 4.45,10.79 4.45,12.7 | 4.45,12.7 4.45,14.61 | v7.62,12.7 6.35,12.7 | 6.35,12.7 4.45,12.7 | C26.1 79.38,19.68 | 92.08,22.23 92.08,19.05 93.34,17.78 J1.3 96.52,16.34 96.52,10.16 VOUT_GREF.1 | 92.08,22.23 J1.2 | R41.1 94.06,27.39 92.08,25.4 | 92.08,25.4 J1.2 | 7.62,27.3 8.89,28.57 | 4.45,25.4 6.35,27.3 | 6.35,12.7 4.45,14.61 | 24.77,19.68 24.77,24.77 26.04,26.04 | v17.78,12.7 19.05,12.7 21.59,10.16 | LM2917_8.1 17.78,17.78 22.86,17.78 | 95.89,27.3 95.25,27.94 93.34,27.94 92.08,26.67 92.08,25.4 | 92.08,22.23 93.34,22.23 93.34,19.05 93.98,18.41 94.61,18.41 95.25,17.78
V_CONTROL
  Bottom 1.27: R30.2 77.47,27.3 82.55,32.38 R41.2

### Text on the board
bRestrict: Proximity Sensor V1.0